# Altium schematic sheet L4_Controller.SchDoc
size 612 x 281 mm; SheetNumber: 1; SheetTotal: 1
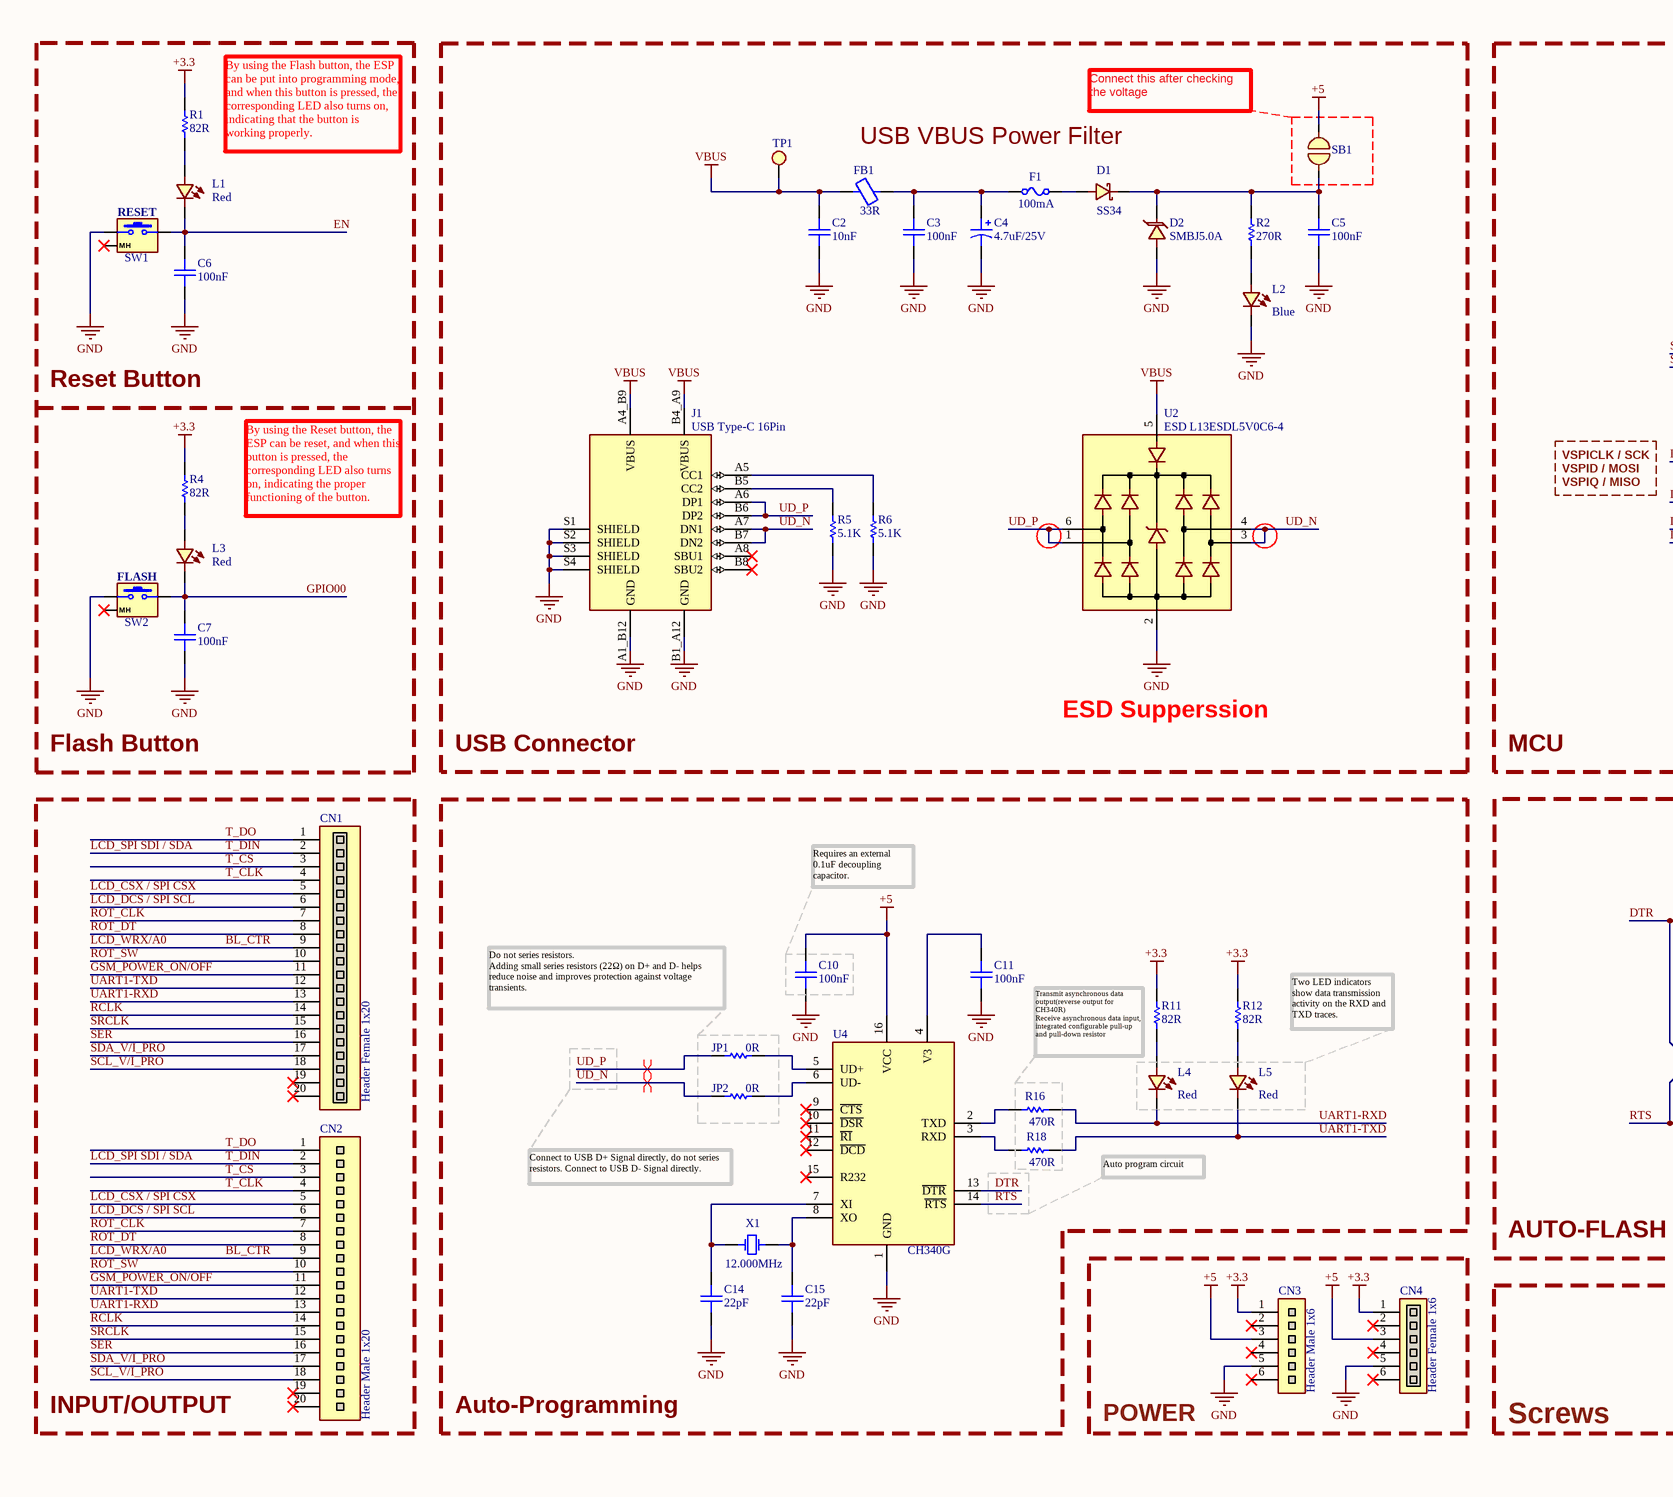
[diagram p0: L4_Controller.SchDoc, left]
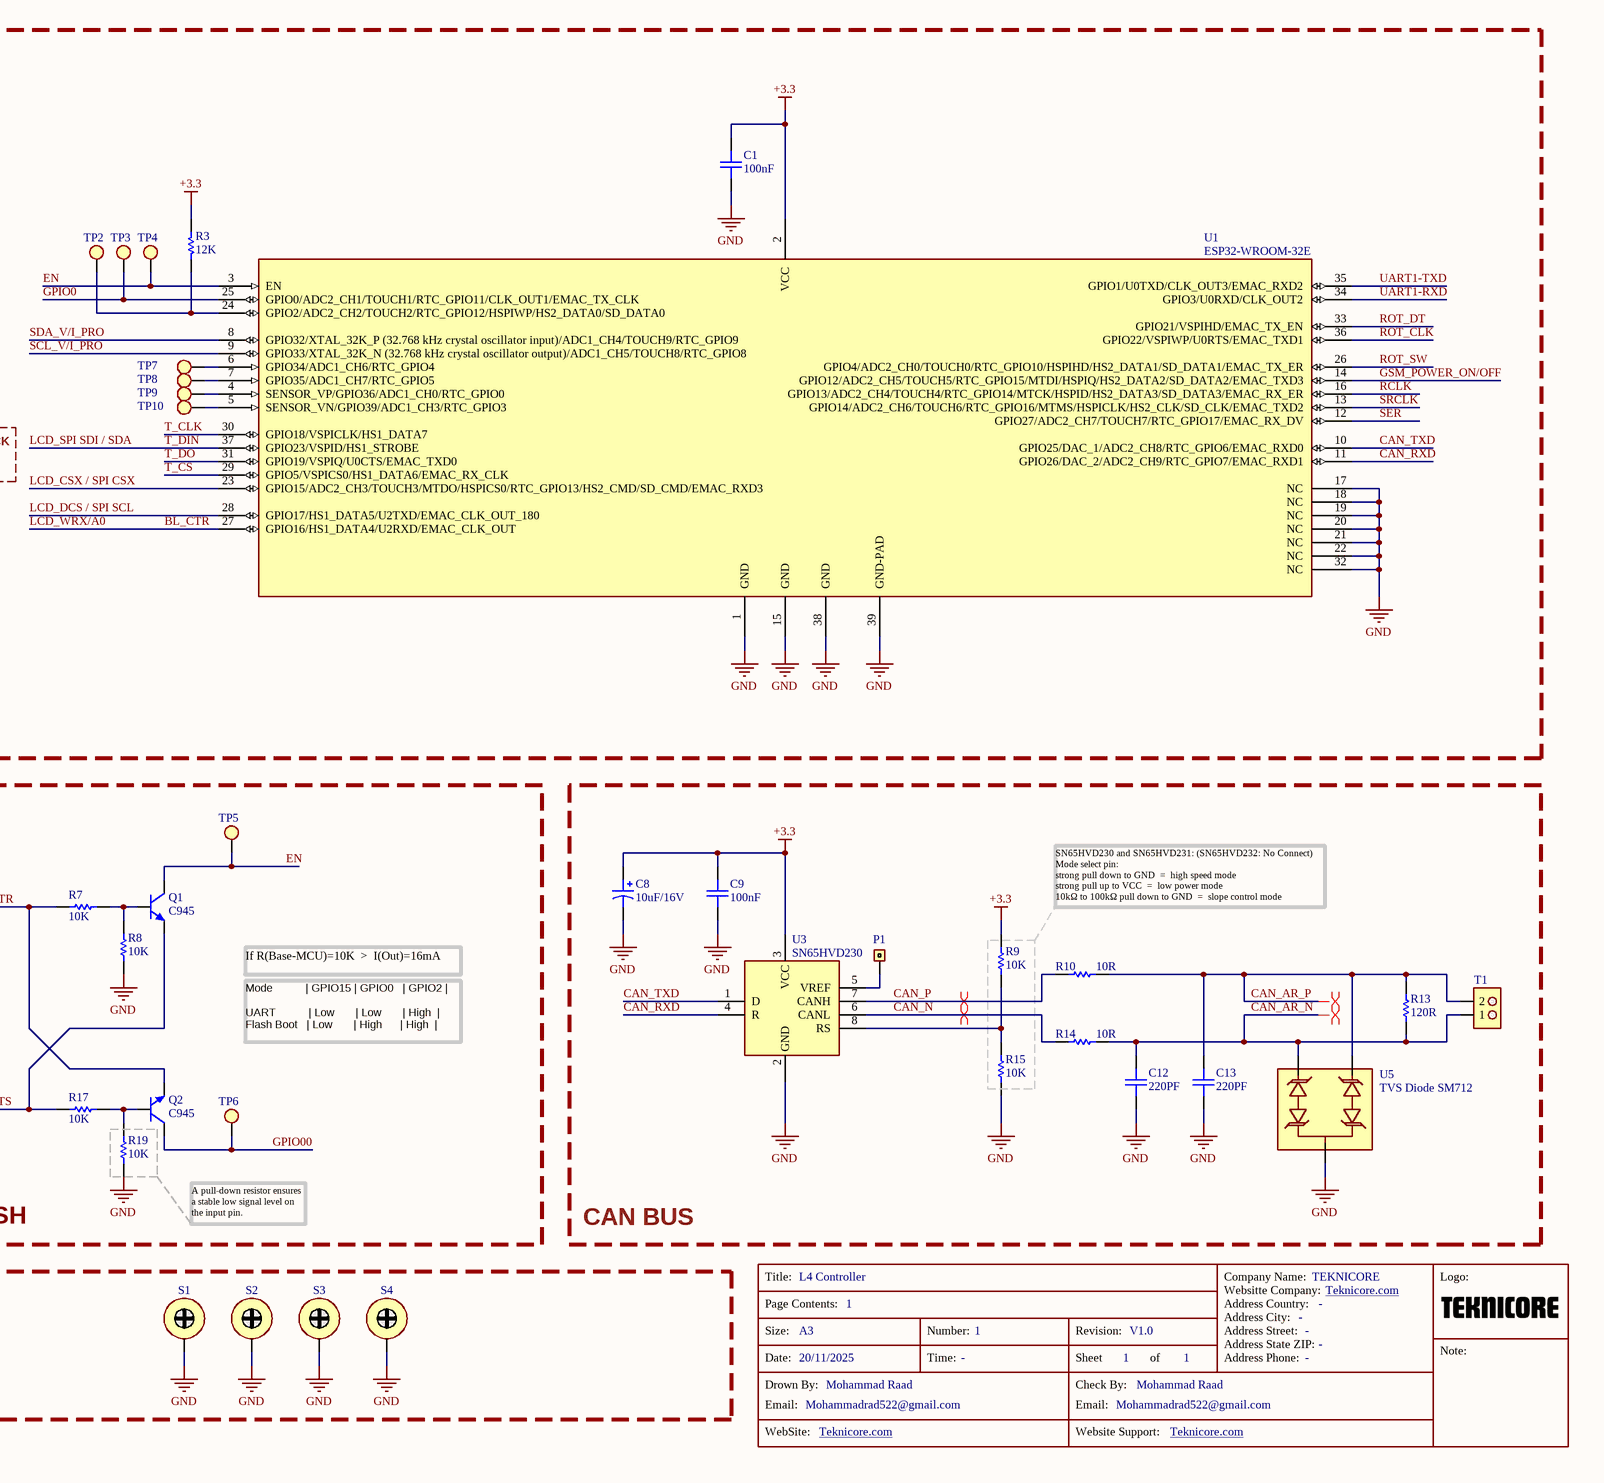
[diagram p1: L4_Controller.SchDoc, right]

## Parts
C1  100nF  [CAP1206]
C2  10nF  [CAP1206]
C3  100nF  [CAP1206]
C4  4.7uF/25V  [CAP_EL_0810]
C5  100nF  [CAP1206]
C6  100nF  [CAP1206]
C7  100nF  [CAP1206]
C8  10uF/16V  [CAP_EL_0810]
C9  100nF  [CAP1206]
C10  100nF  [CAP1206]
C11  100nF  [CAP1206]
C12  220PF  [CAP1206]
C13  220PF  [CAP1206]
C14  22pF  [CAP1206]
C15  22pF  [CAP1206]
CN1  Header Female 1x20  [HDR_F_1x20PIN_0.2"]
CN2  Header Male 1x20  [HDR_M_1x20PIN_0.2"]
CN3  Header Male 1x6  [HDR_M_1x6PIN_0.2"]
CN4  Header Female 1x6  [HDR_F_1x6PIN_0.2"]
D1  SS34  [Diode DO-214AC SMA]
D2  SMBJ5.0A  [Diode DO-214AA SMB]
F1  100mA  [FUSE 1206]
FB1  33R  [Resistor_SMD_1206]
J1  USB Type-C 16Pin  [USB-TYPE-C16PIN]
JP1  0R  [Resistor_SMD_1206]
JP2  0R  [Resistor_SMD_1206]
L1  Red  [LED 1206]
L2  Blue  [LED 1206]
L3  Red  [LED 1206]
L4  Red  [LED 1206]
L5  Red  [LED 1206]
P1  Header 1x1  [HDR 1X1-2.54mm]  (value not drawn)
Q1  C945  [SOT23_M]
Q2  C945  [SOT23_M]
R1  82R  [Resistor_SMD_1206]
R2  270R  [Resistor_SMD_1206]
R3  12K  [Resistor_SMD_1206]
R4  82R  [Resistor_SMD_1206]
R5  5.1K  [Resistor_SMD_1206]
R6  5.1K  [Resistor_SMD_1206]
R7  10K  [Resistor_SMD_1206]
R8  10K  [Resistor_SMD_1206]
R9  10K  [Resistor_SMD_1206]
R10  10R  [Resistor_SMD_1206]
R11  82R  [Resistor_SMD_1206]
R12  82R  [Resistor_SMD_1206]
R13  120R  [Resistor_SMD_1206]
R14  10R  [Resistor_SMD_1206]
R15  10K  [Resistor_SMD_1206]
R16  470R  [Resistor_SMD_1206]
R17  10K  [Resistor_SMD_1206]
R18  470R  [Resistor_SMD_1206]
R19  10K  [Resistor_SMD_1206]
S1  Screw  [Screw 3mm-Invirons 0.254mm]  (value not drawn)
S2  Screw  [Screw 3mm-Invirons 0.254mm]  (value not drawn)
S3  Screw  [Screw 3mm-Invirons 0.254mm]  (value not drawn)
S4  Screw  [Screw 3mm-Invirons 0.254mm]  (value not drawn)
SB1  Solder Bridge  [SolderBridge_NC (100x80)(20)mil]  (value not drawn)
SW1  Push Button  [SW_PushBotton_Right]  (value not drawn)
SW2  Push Button  [SW_PushBotton_Right]  (value not drawn)
T1  KF301 2PIN  [KF301 2Pin Mini]  (value not drawn)
T?  Title: L4 Controller  Page Conteents: 1  Size: A3  Drawn By: Mohammad Raad  Drown By (Email): Mohammadrad522@gmail.com  Website: Teknicore.com  Date: 20/11/2025  Reversion: V1.0  Company Name: TEKNICORE  (hidden comment: Title Block)  (graphical)
TP1  Test Point  [TestPoint_SMD_Circle_1.5mm]  (value not drawn)
TP2  Test Point  [TestPoint_SMD_Circle_1.5mm]  (value not drawn)
TP3  Test Point  [TestPoint_SMD_Circle_1.5mm]  (value not drawn)
TP4  Test Point  [TestPoint_SMD_Circle_1.5mm]  (value not drawn)
TP5  Test Point  [TestPoint_SMD_Circle_1.5mm]  (value not drawn)
TP6  Test Point  [TestPoint_SMD_Circle_1.5mm]  (value not drawn)
TP7  Test Point  [TestPoint_SMD_Circle_1.5mm]  (value not drawn)
TP8  Test Point  [TestPoint_SMD_Circle_1.5mm]  (value not drawn)
TP9  Test Point  [TestPoint_SMD_Circle_1.5mm]  (value not drawn)
TP10  Test Point  [TestPoint_SMD_Circle_1.5mm]  (value not drawn)
U1  ESP32-WROOM-32E  [ESP32-WROOM-32E]
U2  ESD L13ESDL5V0C6-4  [SOT23-6L]
U3  SN65HVD230  [SOIC8]
U4  CH340G  [SOIC16]
U5  TVS Diode SM712  [SOT23_M]
X1  12.000MHz  [Crystal HC-49/US-SMD]

## Blocks framed on the sheet
MCU: C1 R3 TP2-TP4 TP7-TP10 U1
INPUT/OUTPUT: CN1 CN2
Auto-Programming: C10 C11 C14 C15 JP1 JP2 L4 L5 R11 R12 R16 R18 U4 X1
AUTO-FLASH: Q1 Q2 R7 R8 R17 R19 TP5 TP6
CAN BUS: C8 C9 C12 C13 P1 R9 R10 R13-R15 T1 U3 U5
POWER: CN3 CN4
Screws: S1-S4

## Nets
+3.3: C1.2 C8.1 C9.2 CN3.1 CN4.1 R1.2 R3.2 R4.2 R9.1 R11.2 R12.2 U1.2(VCC) U3.3(VCC)
+5: C10.2 CN3.3 CN4.3 SB1.2 U4.16(VCC)
GND: C1.1 C2.1 C3.1 C4.2 C5.1 C6.1 C7.1 C8.2 C9.1 C10.1 C11.1 C12.1 C13.1 C14.1 C15.1 CN3.5 CN4.5 D2.1(A) J1.A1_B12(GND) J1.B1_A12(GND) J1.S1(SHIELD) J1.S2(SHIELD) J1.S3(SHIELD) J1.S4(SHIELD) L2.K R5.1 R6.1 R8.1 R15.1 R19.1 S1.S S2.S S3.S S4.S SW1.1 SW2.1 U1.1(GND) U1.15(GND) U1.17(NC) U1.18(NC) U1.19(NC) U1.20(NC) U1.21(NC) U1.22(NC) U1.32(NC) U1.38(GND) U1.39(GND-PAD) U2.2(GND) U3.2(GND) U4.1(GND) U5.3(GND)
VBUS: C2.2 FB1.2 J1.A4_B9(VBUS) J1.B4_A9(VBUS) TP1.1 U2.5(VBUS)
BL_CTR: CN1.9 CN2.9 U1.27(GPIO16/HS1_DATA4/U2RXD/EMAC_CLK_OUT)  [also labelled LCD_WRX/A0]
CAN_AR_N: C12.2 R13.1 R14.2 T1.1 U5.1
CAN_AR_P: C13.2 R10.2 R13.2 T1.2 U5.2
CAN_N: R14.1 U3.6(CANL)
CAN_P: R10.1 U3.7(CANH)
CAN_RXD: U1.11(GPIO26/DAC_2/ADC2_CH9/RTC_GPIO7/EMAC_RXD1) U3.4(R)
CAN_TXD: U1.10(GPIO25/DAC_1/ADC2_CH8/RTC_GPIO6/EMAC_RXD0) U3.1(D)
DTR: Q2.2(E) R7.1 U4.13(~{DTR})
EN: C6.2 L1.K Q1.3(C) SW1.2 TP4.1 TP5.1 U1.3(EN)
GPIO00: C7.2 L3.K Q2.3(C) SW2.2 TP6.1
GPIO0: TP3.1 U1.25(GPIO0/ADC2_CH1/TOUCH1/RTC_GPIO11/CLK_OUT1/EMAC_TX_CLK)
GSM_POWER_ON/OFF: CN1.11 CN2.11 U1.14(GPIO12/ADC2_CH5/TOUCH5/RTC_GPIO15/MTDI/HSPIQ/HS2_DATA2/SD_DATA2/EMAC_TXD3)
LCD_CSX / SPI CSX: CN1.5 CN2.5 U1.23(GPIO15/ADC2_CH3/TOUCH3/MTDO/HSPICS0/RTC_GPIO13/HS2_CMD/SD_CMD/EMAC_RXD3)
LCD_DCS / SPI SCL: CN1.6 CN2.6 U1.28(GPIO17/HS1_DATA5/U2TXD/EMAC_CLK_OUT_180)
LCD_SPI SDI / SDA: CN1.2 CN2.2 U1.37(GPIO23/VSPID/HS1_STROBE)  [also labelled T_DIN]
RCLK: CN1.14 CN2.14 U1.16(GPIO13/ADC2_CH4/TOUCH4/RTC_GPIO14/MTCK/HSPID/HS2_DATA3/SD_DATA3/EMAC_RX_ER)
ROT_CLK: CN1.7 CN2.7 U1.36(GPIO22/VSPIWP/U0RTS/EMAC_TXD1)
ROT_DT: CN1.8 CN2.8 U1.33(GPIO21/VSPIHD/EMAC_TX_EN)
ROT_SW: CN1.10 CN2.10 U1.26(GPIO4/ADC2_CH0/TOUCH0/RTC_GPIO10/HSPIHD/HS2_DATA1/SD_DATA1/EMAC_TX_ER)
RTS: Q1.2(E) R17.1 U4.14(~{RTS})
SCL_V/I_PRO: CN1.18 CN2.18 U1.9(GPIO33/XTAL_32K_N_(32.768_kHz_crystal_oscillator_output)/ADC1_CH5/TOUCH8/RTC_GPIO8)
SDA_V/I_PRO: CN1.17 CN2.17 U1.8(GPIO32/XTAL_32K_P_(32.768_kHz_crystal_oscillator_input)/ADC1_CH4/TOUCH9/RTC_GPIO9)
SER: CN1.16 CN2.16 U1.12(GPIO27/ADC2_CH7/TOUCH7/RTC_GPIO17/EMAC_RX_DV)
SRCLK: CN1.15 CN2.15 U1.13(GPIO14/ADC2_CH6/TOUCH6/RTC_GPIO16/MTMS/HSPICLK/HS2_CLK/SD_CLK/EMAC_TXD2)
T_CLK: CN1.4 CN2.4 U1.30(GPIO18/VSPICLK/HS1_DATA7)
T_CS: CN1.3 CN2.3 U1.29(GPIO5/VSPICS0/HS1_DATA6/EMAC_RX_CLK)
T_DO: CN1.1 CN2.1 U1.31(GPIO19/VSPIQ/U0CTS/EMAC_TXD0)
UART1-RXD: CN1.13 CN2.13 L4.K R16.2 U1.34(GPIO3/U0RXD/CLK_OUT2)
UART1-TXD: CN1.12 CN2.12 L5.K R18.2 U1.35(GPIO1/U0TXD/CLK_OUT3/EMAC_RXD2)
UD_N: J1.A7(DN1) J1.B7(DN2) JP2.1 U2.3(I/O2) U2.4(I/O2)
UD_P: J1.A6(DP1) J1.B6(DP2) JP1.1 U2.1(I/O1) U2.6(I/O1)
NetC3_2: C3.2 C4.1 F1.1 FB1.1
NetC5_2: C5.2 D1.2(K) D2.2(K) R2.2 SB1.1
NetC11_2: C11.2 U4.4(V3)
NetC14_2: C14.2 U4.7(XI) X1.2
NetC15_2: C15.2 U4.8(XO) X1.1
NetD1_1: D1.1(A) F1.2
NetJ1_A5: J1.A5(CC1) R6.2
NetJ1_B5: J1.B5(CC2) R5.2
NetJP1_2: JP1.2 U4.5(UD+)
NetJP2_2: JP2.2 U4.6(UD-)
NetL1_A: L1.A R1.1
NetL2_A: L2.A R2.1
NetL3_A: L3.A R4.1
NetL4_A: L4.A R11.1
NetL5_A: L5.A R12.1
NetP1_1: P1.1 U3.5(VREF)
NetQ1_1: Q1.1(B) R7.2 R8.2
NetQ2_1: Q2.1(B) R17.2 R19.2
NetR3_1: R3.1 TP2.1 U1.24(GPIO2/ADC2_CH2/TOUCH2/RTC_GPIO12/HSPIWP/HS2_DATA0/SD_DATA0)
NetR9_2: R9.2 R15.2 U3.8(RS)
NetR16_1: R16.1 U4.2(TXD)
NetR18_1: R18.1 U4.3(RXD)
NetTP7_1: TP7.1 U1.6(GPIO34/ADC1_CH6/RTC_GPIO4)
NetTP8_1: TP8.1 U1.7(GPIO35/ADC1_CH7/RTC_GPIO5)
NetTP9_1: TP9.1 U1.4(SENSOR_VP/GPIO36/ADC1_CH0/RTC_GPIO0)
NetTP10_1: TP10.1 U1.5(SENSOR_VN/GPIO39/ADC1_CH3/RTC_GPIO3)

Not connected (* = marked no-connect by the designer): CN1 19* 20*; CN2 19* 20*; CN3 2* 4* 6*; CN4 2* 4* 6*; J1 A8(SBU1)* B8(SBU2)*; SW1 MH*; SW2 MH*; U4 9(~{CTS})* 10(~{DSR})* 11(~{RI})* 12(~{DCD})* 15(R232)*

## Layout directives
differential pair: CAN_AR_N, CAN_AR_P, CAN_N, CAN_P, UD_N, UD_P

## Notes on the sheet
- By using the Flash button, the ESP can be put into programming mode, and when this button is pressed, the corresponding LED also turns on, indicating that the button is working properly.
- USB VBUS Power Filter
- Connect this after checking the voltage
- (near SW1) RESET
- Reset Button
- VSPICLK / SCK
- VSPID / MOSI
- VSPIQ / MISO
- (near SW2) FLASH
- By using the Reset button, the ESP can be reset, and when this button is pressed, the corresponding LED also turns on, indicating the proper functioning of the button.
- Flash Button
- USB Connector
- ESD Supperssion
- Requires an external 0.1uF decoupling capacitor.
- SN65HVD230 and SN65HVD231: (SN65HVD232: No Connect)
  Mode select pin:
  strong pull down to GND  =  high speed mode
  strong pull up to VCC  =  low power mode
  10kΩ to 100kΩ pull down to GND  =  slope control mode
- (near JP1) Do not series resistors.
  Adding small series resistors (22Ω) on D+ and D- helps reduce noise and improves protection against voltage transients.
- Two LED indicators show data transmission activity on the RXD and TXD traces.
- If R(Base-MCU)=10K  >  I(Out)=16mA
- Transmit asynchronous data output(reverse output for CH340R)
  Receive asynchronous data input, integrated configurable pull-up and pull-down resistor
- Mode           | GPIO15 | GPIO0   | GPIO2 |
  UART           | Low       | Low       | High  |
  Flash Boot   | Low       | High      | High  |
- Auto program circuit
- Connect to USB D+ Signal directly, do not series resistors. Connect to USB D- Signal directly.
- A pull-down resistor ensures a stable low signal level on the input pin.
- (in symbol Title Block) Title:; Company Name:; Logo:; Websitte Company:; Page Contents:; Address Country:; Address City:; Size:; Number:; Revision:; Address Street:; Address State ZIP:; Note:; Date:; Time:; Sheet; of; Address Phone:; Drown By:; Check By:; Email:; WebSite:; Website Support:

## Library data of the parts
C1-C3 C5-C7 C9-C15 = Capacitor Poliester & Ceramic
C4 C8 = Capacitor Electorolytic
D1 = Schottky Diode
D2 = TVS Diode
F1 = Fuse: Fuses
FB1 = Ferrite Bead
J1 = USB Type-C 16Pin: C Type USB Type-C Female Plug 16 Pin Connector Power Charger Jack Port; MF: Shenzen Chuangqin Technology; MP: CQ-USB-C16PSMT01; SnapEDA_Link: https://www.snapeda.com/parts/CQ-USB-C16PSMT01/Shenzen+Chuangqin+Technology/view-part/?ref=snap; Package: Package; Value: *; Check_prices: https://www.snapeda.com/parts/CQ-USB-C16PSMT01/Shenzen+Chuangqin+Technology/view-part/?ref=eda
JP1 JP2 R1-R19 = Resistor
L1-L5 = LED
P1 = Header Male 1x1
Q1 Q2 = C945: NPN Silicon Epitaxial Planar Transistor
SB1 = Solder Bridge Short (NC): Solder Bridge Jumper
SW1 SW2 = Push Button 4PIN Right
T1 = Terminal 2PIN
TP1-TP10 = TestPoint
U1 = ESP32-WROOM-32E: 2.4 GHz Wi-Fi + Bluetooth® + Bluetooth LE module / Built around ESP32 series of SoCs, Xtensa® dual-core 32-bit LX6 microprocessor / 4/8/16 MB flash available / 26 GPIOs, rich set of peripherals / On-board PCB antenna or external antenna connector
U3 = CAN Bus
U4 = CH340G: USB to Serial Port Chip CH340
X1 = Crystal Oscillator
T? = Title Block: Number Sheet: 1; This Sheet Number: 1; All Sheet Number: 1; Checked By: Mohammad Raad; Checked By (Email): Mohammadrad522@gmail.com; Website Support: Teknicore.com; Website Company: Teknicore.com; Address Country: -; Address City: -; Address Country Street: -; Address State ZIP: -; Address Phone: -; Time:: -